# EAGLE design BlackIce_V (EAGLE 7.5.0)
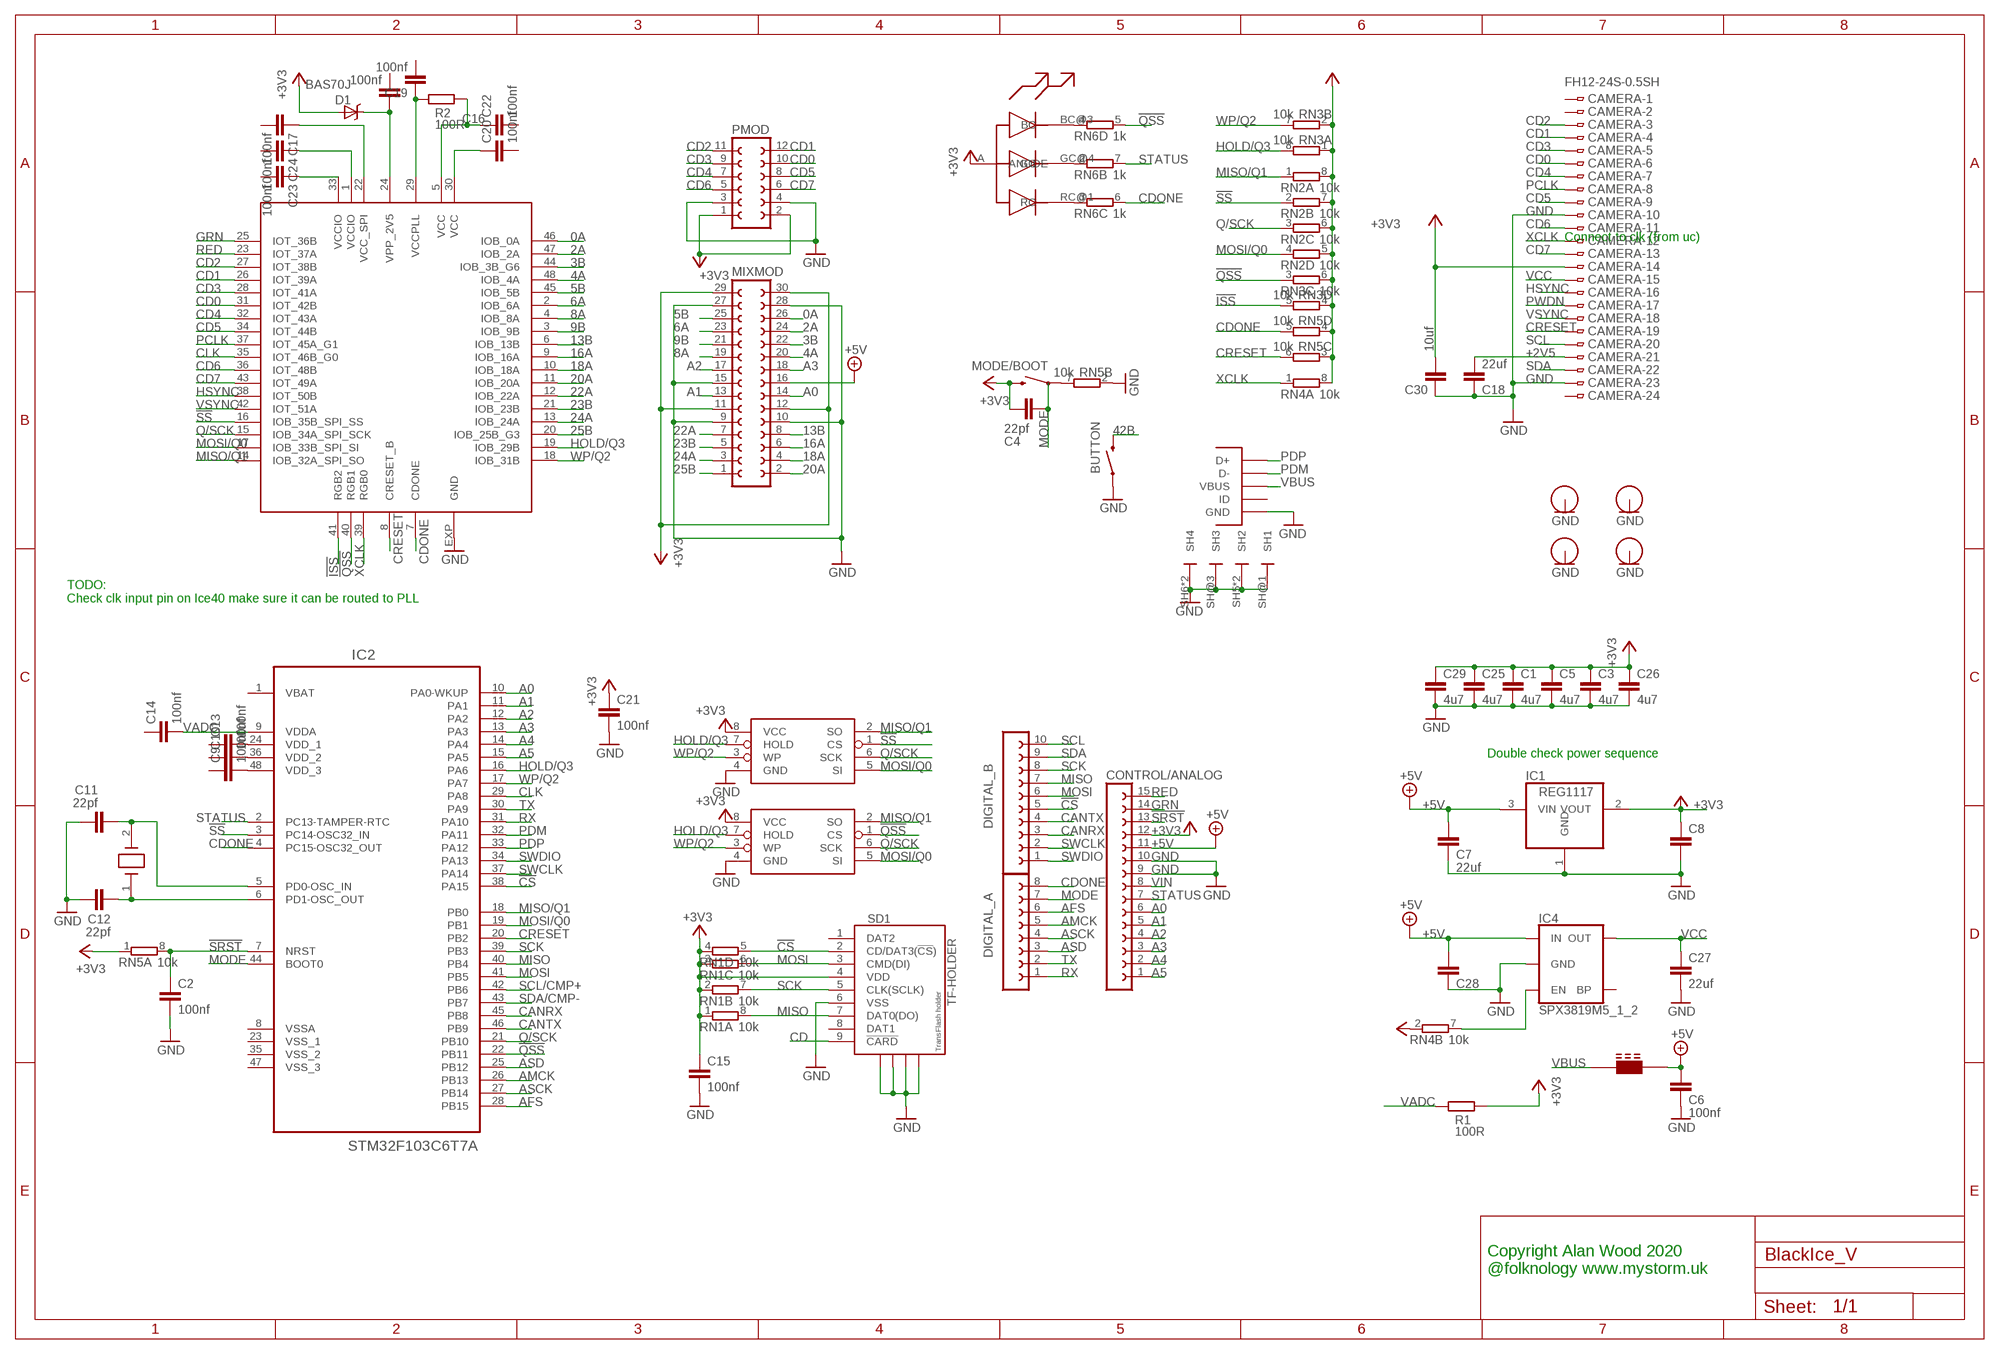
[diagram p0: schematic, sheet 1]

## Parts
BUTTON  SWITCH-MOMENTARY-2SMD-1101NE  [TACTILE-SWITCH-1101NE]
C1  4u7  C-EUC0603  [C0603]
C2  100nf  C-EUC0402  [C0402]
C3  4u7  C-EUC0603  [C0603]
C4  22pf  C-EUC0603  [C0603]
C5  4u7  C-EUC0603  [C0603]
C6  100nf  C-EUC0402  [C0402]
C7  22uf  C-EUC0603  [C0603]
C8  22uf  C-EUC0603  [C0603]
C9  100nf  C-EUC0402  [C0402]
C10  100nf  C-EUC0402  [C0402]
C11  22pf  C-EUC0603  [C0603]
C12  22pf  C-EUC0603  [C0603]
C13  100nf  C-EUC0402  [C0402]
C14  100nf  C-EUC0402  [C0402]
C15  100nf  C-EUC0402  [C0402]
C16  100nf  C-EUC0402  [C0402]
C17  100nf  C-EUC0402  [C0402]
C18  22uf  C-EUC0603  [C0603]
C19  100nf  C-EUC0402  [C0402]
C20  100nf  C-EUC0402  [C0402]
C21  100nf  C-EUC0402  [C0402]
C22  100nf  C-EUC0402  [C0402]
C23  100nf  C-EUC0402  [C0402]
C24  100nf  C-EUC0402  [C0402]
C25  4u7  C-EUC0603  [C0603]
C26  4u7  C-EUC0603  [C0603]
C27  22uf  C-EUC0603  [C0603]
C28  22uf  C-EUC0603  [C0603]
C29  4u7  C-EUC0603  [C0603]
C30  10uf  C-EUC0603  [C0603]
CAMERA  FH12-24S-0.5SH  [FH12-24S-0.5SH]
CONTROL/ANALOG  FE15-1  [FE15]
D1  BAS70J  [SOD-323]
DIGITAL_A  FE08-1  [FE08]
DIGITAL_B  FE10-1  [FE10]
FB1  FERRITE_BEAD  [0603]
H1  HOLE2.5MM  [2.5MM-HOLE]
H2  HOLE2.5MM  [2.5MM-HOLE]
H3  HOLE2.5MM  [2.5MM-HOLE]
H4  HOLE2.5MM  [2.5MM-HOLE]
IC1  REG1117  [SOT223]
IC2  STM32F103C6T7A  [QFP50P900X900X160-48N]
IC3  ICE40UP5K  [QFN48]
IC4  SPX3819M5_1_2  V_REG_SPX3819-SOT23-5  [SOT23-5]
IC5  AT25SDF041A  [SOIC-8-NARROW]
IC6  AT25SDF041A  [SOIC-8-NARROW]
MIXMOD  FE15-2  [FE15-2]
MODE/BOOT  SWITCH-MOMENTARY-2SMD-1101NE  [TACTILE-SWITCH-1101NE]
PMOD  FE06-2W  [FE06-2W]
R1  100R  R-EU_R0402  [R0402]
R2  100R  R-EU_R0402  [R0402]
RN1  10k  4R-N0603-ARV  [0603-ARV]
RN2  10k  4R-N0603-ARV  [0603-ARV]
RN3  10k  4R-N0603-ARV  [0603-ARV]
RN4  10k  4R-N0603-ARV  [0603-ARV]
RN5  10k  4R-N0603-ARV  [0603-ARV]
RN6  1k  4R-N0603-ARV  [0603-ARV]
SD1  TF-HOLDER  [TF-PULL]
U$1  FCI-MICROUSB-B-PEG  [MICROUSB-B-PEG]
U$4  RGB-PLCC-4  [PLCC-4-SMALL]
X1  HC49UP  [HC49UP]

## Nets
0A: IC3.46(IOB_0A) MIXMOD.26
2A: IC3.47(IOB_2A) MIXMOD.24
3B: IC3.44(IOB_3B_G6) MIXMOD.22
4A: IC3.48(IOB_4A) MIXMOD.20
5B: IC3.45(IOB_5B) MIXMOD.25
6A: IC3.2(IOB_6A) MIXMOD.23
8A: IC3.4(IOB_8A) MIXMOD.19
9B: IC3.3(IOB_9B) MIXMOD.21
13B: IC3.6(IOB_13B) MIXMOD.8
16A: IC3.9(IOB_16A) MIXMOD.6
18A: IC3.10(IOB_18A) MIXMOD.4
20A: IC3.11(IOB_20A) MIXMOD.2
22A: IC3.12(IOB_22A) MIXMOD.7
23B: IC3.21(IOB_23B) MIXMOD.5
24A: IC3.13(IOB_24A) MIXMOD.3
25B: IC3.20(IOB_25B_G3) MIXMOD.1
42B: BUTTON.2
!CS: DIGITAL_B.5 IC2.38(PA15) RN1.5 SD1.2(CD/DAT3(!CS!))
!ISS: IC3.41(RGB2) RN3.5
!QSS: IC2.22(PB11) IC3.40(RGB1) IC6.1(CS) RN3.3 RN6.5
!SRST: C2.1 CONTROL/ANALOG.13 IC2.7(NRST) RN5.8
!SS: IC2.3(PC14-OSC32_IN) IC3.16(IOB_35B_SPI_SS) IC5.1(CS) RN2.2
+2V5: C16.1 C18.1 CAMERA.21 D1.C IC3.24(VPP_2V5)
+3V3: C1.1 C3.1 C4.2 C5.1 C8.1 C15.1 C21.1 C25.1 C26.1 C29.1 C30.2 CAMERA.14 CONTROL/ANALOG.12 D1.A IC1.2(VOUT) IC5.8(VCC) IC6.8(VCC) MIXMOD.11 MIXMOD.12 MIXMOD.29 MIXMOD.30 MODE/BOOT.2 PMOD.1 PMOD.2 R1.1 RN1.1 RN1.2 RN1.3 RN1.4 RN2.5 RN2.6 RN2.7 RN2.8 RN3.1 RN3.2 RN3.4 RN3.6 RN4.2 RN4.8 RN5.1 RN5.3 RN5.4 SD1.4(VDD) U$4.A(ANODE)
+5V: C6.2 C7.2 C28.2 CONTROL/ANALOG.11 FB1.2 IC1.3(VIN) IC4.1(IN) MIXMOD.16
A0: CONTROL/ANALOG.6 IC2.10(PA0-WKUP) MIXMOD.14
A1: CONTROL/ANALOG.5 IC2.11(PA1) MIXMOD.13
A2: CONTROL/ANALOG.4 IC2.12(PA2) MIXMOD.17
A3: CONTROL/ANALOG.3 IC2.13(PA3) MIXMOD.18
A4: CONTROL/ANALOG.2 IC2.14(PA4)
A5: CONTROL/ANALOG.1 IC2.15(PA5)
AFS: DIGITAL_A.6 IC2.28(PB15)
AMCK: DIGITAL_A.5 IC2.26(PB13)
ASCK: DIGITAL_A.4 IC2.27(PB14)
ASD: DIGITAL_A.3 IC2.25(PB12)
CANRX: DIGITAL_B.3 IC2.45(PB8)
CANTX: DIGITAL_B.4 IC2.46(PB9)
CD: SD1.9(!CARD)
CD0: CAMERA.6 IC3.31(IOT_42B) PMOD.10
CD1: CAMERA.4 IC3.26(IOT_39A) PMOD.12
CD2: CAMERA.3 IC3.27(IOT_38B) PMOD.11
CD3: CAMERA.5 IC3.28(IOT_41A) PMOD.9
CD4: CAMERA.7 IC3.32(IOT_43A) PMOD.7
CD5: CAMERA.9 IC3.34(IOT_44B) PMOD.8
CD6: CAMERA.11 IC3.36(IOT_48B) PMOD.5
CD7: CAMERA.13 IC3.43(IOT_49A) PMOD.6
CDONE: DIGITAL_A.8 IC2.4(PC15-OSC32_OUT) IC3.7(CDONE) RN5.5 RN6.6
CLK: IC2.29(PA8) IC3.35(IOT_46B_G0)
CRESET: CAMERA.19 IC2.20(PB2) IC3.8(CRESET_B) RN5.6
GND: BUTTON.1 C1.2 C2.2 C3.2 C5.2 C6.1 C7.1 C8.2 C11.1 C12.1 C15.2 C18.2 C21.2 C25.2 C26.2 C27.2 C28.1 C29.2 C30.1 CAMERA.10 CAMERA.23 CONTROL/ANALOG.9 CONTROL/ANALOG.10 H1.P$1(P) H2.P$1(P) H3.P$1(P) H4.P$1(P) IC1.1(GND) IC3.EXP(GND) IC4.2(GND) IC5.4(GND) IC6.4(GND) MIXMOD.9 MIXMOD.10 MIXMOD.15 MIXMOD.27 MIXMOD.28 PMOD.3 PMOD.4 RN5.2 SD1.6(VSS) SD1.S1 SD1.S2 SD1.S3 SD1.S4 U$1.P$5(GND) U$1.SH5(SH2) U$1.SH6(SH4) U$1.SH@1(SH1) U$1.SH@2(SH2) U$1.SH@3(SH3) U$1.SH@4(SH4)
GRN: CONTROL/ANALOG.14 IC3.25(IOT_36B)
HOLD/Q3: IC2.16(PA6) IC3.19(IOB_29B) IC5.7(HOLD) IC6.7(HOLD) RN3.8
HSYNC: CAMERA.16 IC3.38(IOT_50B)
MISO: DIGITAL_B.7 IC2.40(PB4) RN1.8 SD1.7(DAT0(DO))
MISO/Q1: IC2.18(PB0) IC3.14(IOB_32A_SPI_SO) IC5.2(SO) IC6.2(SO) RN2.1
MODE: C4.1 DIGITAL_A.7 IC2.44(BOOT0)
MOSI: DIGITAL_B.6 IC2.41(PB5) RN1.6 SD1.3(CMD(DI))
MOSI/Q0: IC2.19(PB1) IC3.17(IOB_33B_SPI_SI) IC5.5(SI) IC6.5(SI) RN2.4
N$2: RN6.4 U$4.BC@3(BC)
N$7: RN6.2 U$4.GC@4(GC)
N$9: RN6.3 U$4.RC@1(RC)
N$11: MODE/BOOT.1 RN5.7
N$12: IC4.3(EN) RN4.7
N$22: C12.2 IC2.6(PD1-OSC_OUT) X1.1(X1)
N$23: C11.2 IC2.5(PD0-OSC_IN) X1.2(X2)
N$29: C13.2 IC2.24(VDD_1)
N$30: C10.2 IC2.36(VDD_2)
N$31: C9.2 IC2.48(VDD_3)
N$32: C23.1 IC3.33(VCCIO)
N$33: C24.1 IC3.1(VCCIO)
N$34: C17.1 IC3.22(VCC_SPI)
N$36: C19.1 IC3.29(VCCPLL) R2.2
N$37: C22.1 IC3.5(VCC) R2.1
N$38: C20.1 IC3.30(VCC)
PCLK: CAMERA.8 IC3.37(IOT_45A_G1)
PDM: IC2.32(PA11) U$1.P$2(D-)
PDP: IC2.33(PA12) U$1.P$3(D+)
PWDN: CAMERA.17
Q/SCK: IC2.21(PB10) IC3.15(IOB_34A_SPI_SCK) IC5.6(SCK) IC6.6(SCK) RN2.3
RED: CONTROL/ANALOG.15 IC3.23(IOT_37A)
RX: DIGITAL_A.1 IC2.31(PA10)
SCK: DIGITAL_B.8 IC2.39(PB3) RN1.7 SD1.5(CLK(SCLK))
SCL: CAMERA.20 DIGITAL_B.10
SCL/CMP+: IC2.42(PB6)
SDA: CAMERA.22 DIGITAL_B.9
SDA/CMP-: IC2.43(PB7)
STATUS: CONTROL/ANALOG.7 IC2.2(PC13-TAMPER-RTC)
SWCLK: DIGITAL_B.2 IC2.37(PA14)
SWDIO: DIGITAL_B.1 IC2.34(PA13)
TX: DIGITAL_A.2 IC2.30(PA9)
VADC: C14.2 IC2.9(VDDA) R1.2
VBUS: FB1.1 U$1.P$1(VBUS)
VCC: C27.1 CAMERA.15 IC4.5(OUT)
VIN: CONTROL/ANALOG.8
VSYNC: CAMERA.18 IC3.42(IOT_51A)
WP/Q2: IC2.17(PA7) IC3.18(IOB_31B) IC5.3(WP) IC6.3(WP) RN3.7
XCLK: CAMERA.12 IC3.39(RGB0) RN4.1
Unconnected: C9.1 C10.1 C13.1 C14.1 C16.2 C17.2 C19.2 C20.2 C22.2 C23.2 C24.2 CAMERA.1 CAMERA.2 CAMERA.24 IC2.8(VSSA) IC2.23(VSS_1) IC2.35(VSS_2) IC2.47(VSS_3) IC4.4(BP) RN4.3 RN4.4 RN4.5 RN4.6 RN6.1 RN6.7 RN6.8 SD1.1(DAT2) SD1.8(DAT1) U$1.P$4(ID)

## Notes on the sheet
- Connect to clk (from uc)
- TODO:
  Check clk input pin on Ice40 make sure it can be routed to PLL
- Double check power sequence
- Copyright Alan Wood 2020
  @folknology www.mystorm.uk

## Power pins joined to a net without a drawn wire
VBAT: IC2.1(VBAT)

## Library data of the parts
BUTTON MODE/BOOT = SparkFun-Electromechanical:SWITCH-MOMENTARY-2: Various NO switches- pushbuttons, reed, etc; PROD_ID: SWCH-00815
C1-C30 = rcl:C-EU: CAPACITOR, European symbol
CAMERA = con-hirose:FH12-24S-0.5S: 0.5mm Pitch Connectors For FPC/FFC Source: Data sheet <http://www.hirose.co.jp/cataloge_hp/e58605370.pdf>; MPN: FH12-24S-0.5SH(55); OC_FARNELL: 1324552; OC_NEWARK: 34M6170
CONTROL/ANALOG = con-lsta:FE15-1: FEMALE HEADER; OC_FARNELL: unknown; OC_NEWARK: unknown
D1 = ELL-i-DiscreteSemi:BAS70: Silicon Schottky Diodes General-purpose diode for high-speed switching. Maximum forward current 70 mA Maxiumum forward voltage drop Vf 0.410 mV Maximum reverse voltage 70V
DIGITAL_A = con-lsta:FE08-1: FEMALE HEADER; OC_FARNELL: unknown; OC_NEWARK: unknown
DIGITAL_B = con-lsta:FE10-1: FEMALE HEADER; OC_FARNELL: unknown; OC_NEWARK: unknown
FB1 = amino:FERRITE_BEAD
H1-H4 = amino:HOLE
IC1 = burr-brown:REG1117: 800mA and 1A Low Dropout (LDO) Positive Regulator 1.8V, 2.5V, 2.85V, 3.3V, 5V, and Adj; MPN: REG1117; OC_FARNELL: 1097566; OC_NEWARK: 14P6981
IC2 = stm:STM32F103C6T7A: IC, MCU, 32BIT, 32KB FLASH, 48 LQFP; MPN: STM32F103C6T7A; OC_FARNELL: 2060890; OC_NEWARK: 65T3773; PACKAGE: 48LQFP; SUPPLIER: STMicroelectronics
IC3 = amino:ICE40UP5K
IC4 = SparkFun-IC-Power:V_REG_SPX3819: SPX3819 Voltage Regulator 3.3V 500mA, 16V input Datasheet <https://www.exar.com/content/document.ashx?id=22106> SparkFun Products: SparkFun Serial Controlled Motor Driver <https://www.sparkfun.com/products/13911>; PROD_ID: VREG-13321; VALUE: SPX3819M5_3_3
IC5 IC6 = amino:AT25SDF041A
MIXMOD = con-lsta:FE15-2: FEMALE HEADER; OC_FARNELL: unknown; OC_NEWARK: unknown
PMOD = con-lsta:FE06-2W: FEMALE HEADER; OC_FARNELL: unknown; OC_NEWARK: unknown
R1 R2 = resistor:R-EU_: RESISTOR, European symbol
RN1-RN6 = resistor-dil:4R-N: Array Chip Resistor Source: RS Component / Phycomp; OC_FARNELL: unknown; OC_NEWARK: unknown
SD1 = sd-mmc:TF-HOLDER: TF / Micro SD socket is PUSH-PUSH type, the card can be pushed into and auto locked and pushed out by simply press the card. Surface Mounting type.
U$1 = amino:FCI-MICROUSB-B-PEG
U$4 = amino:RGB-PLCC-4
X1 = amino:HC49UP

## Board
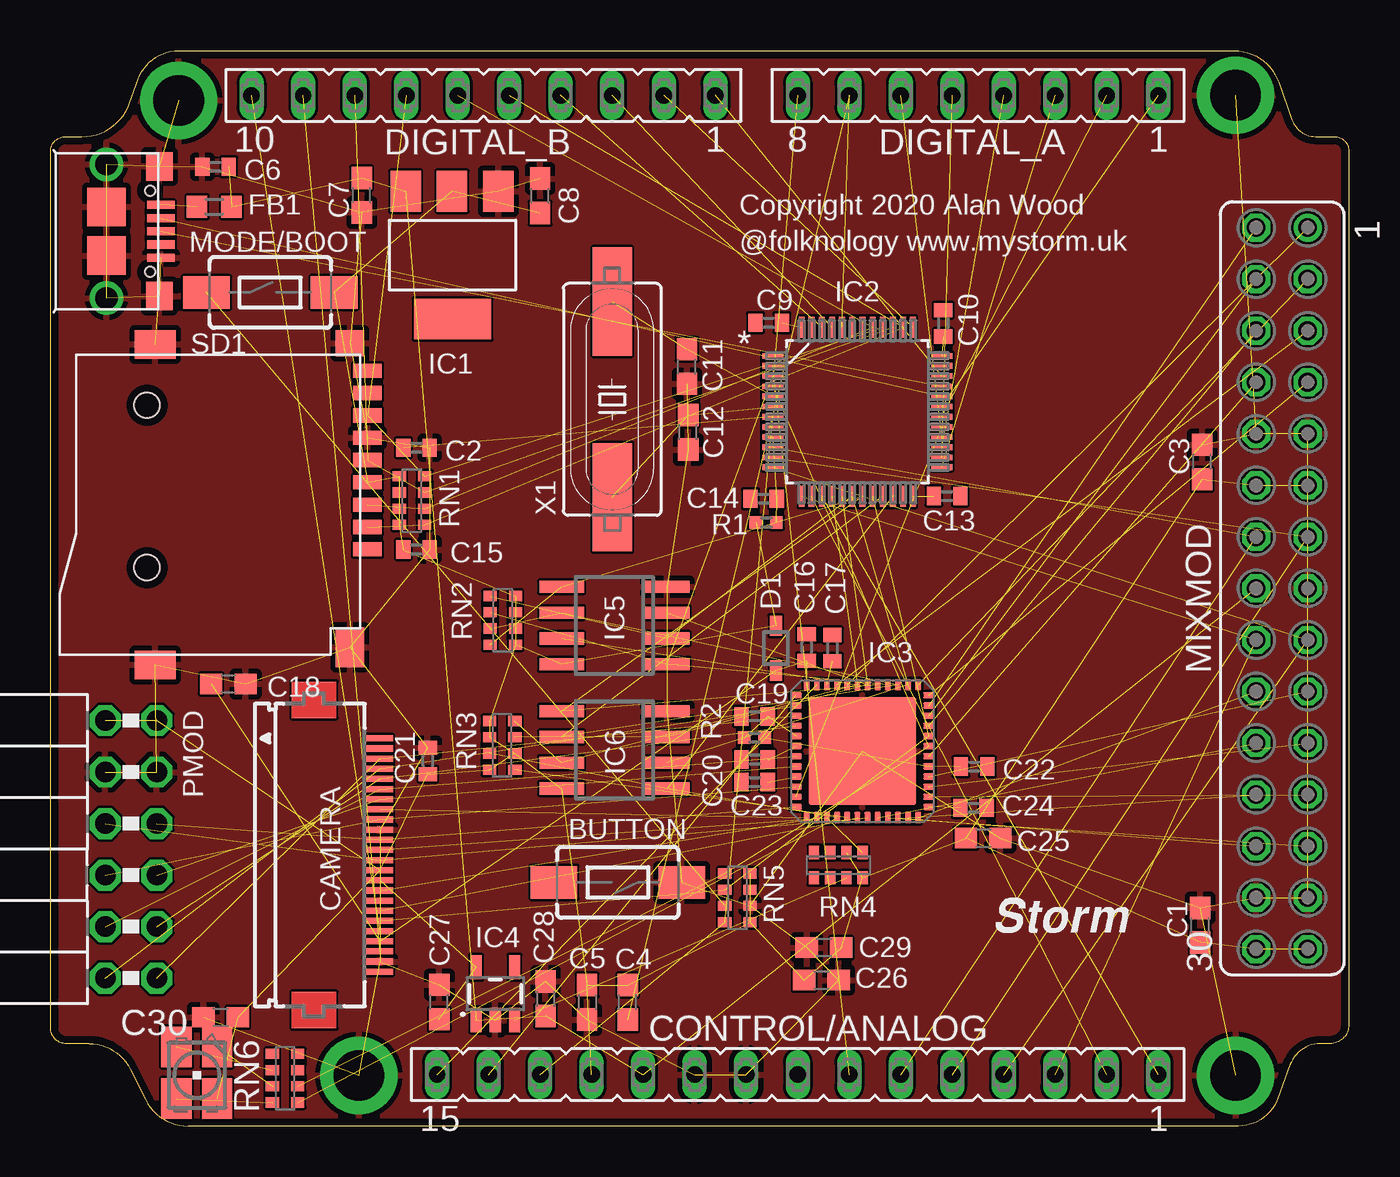
[diagram p1: board, top side]
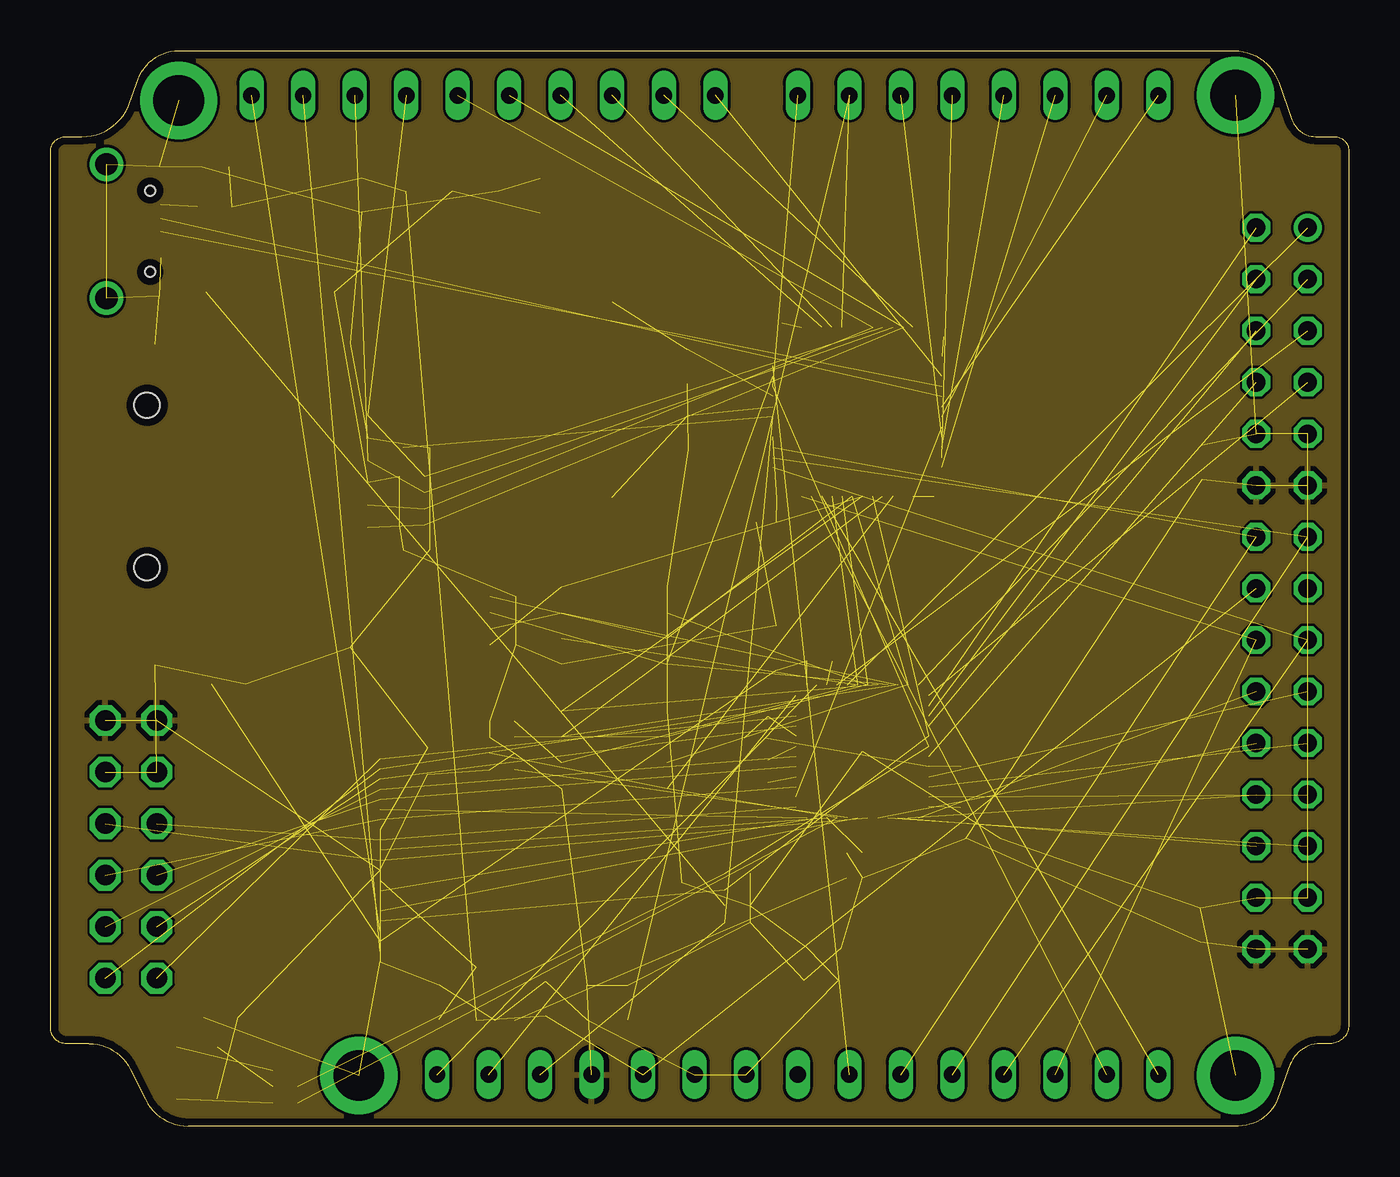
[diagram p2: board, inner layer Route2]
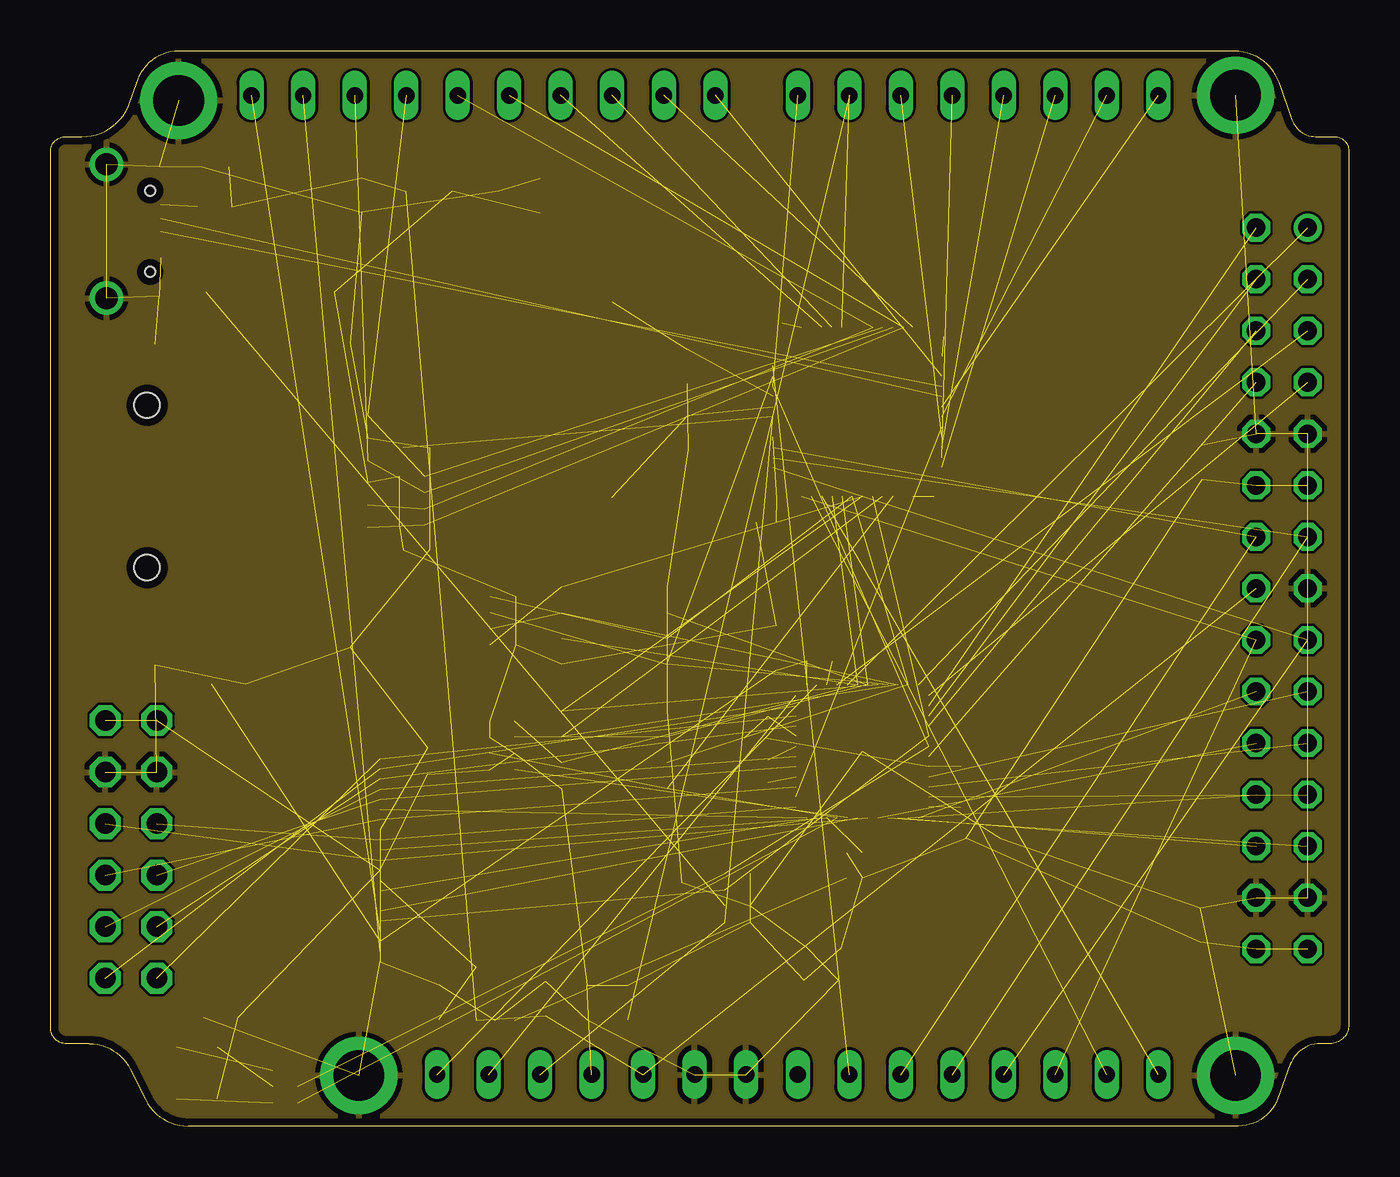
[diagram p3: board, inner layer Route15]
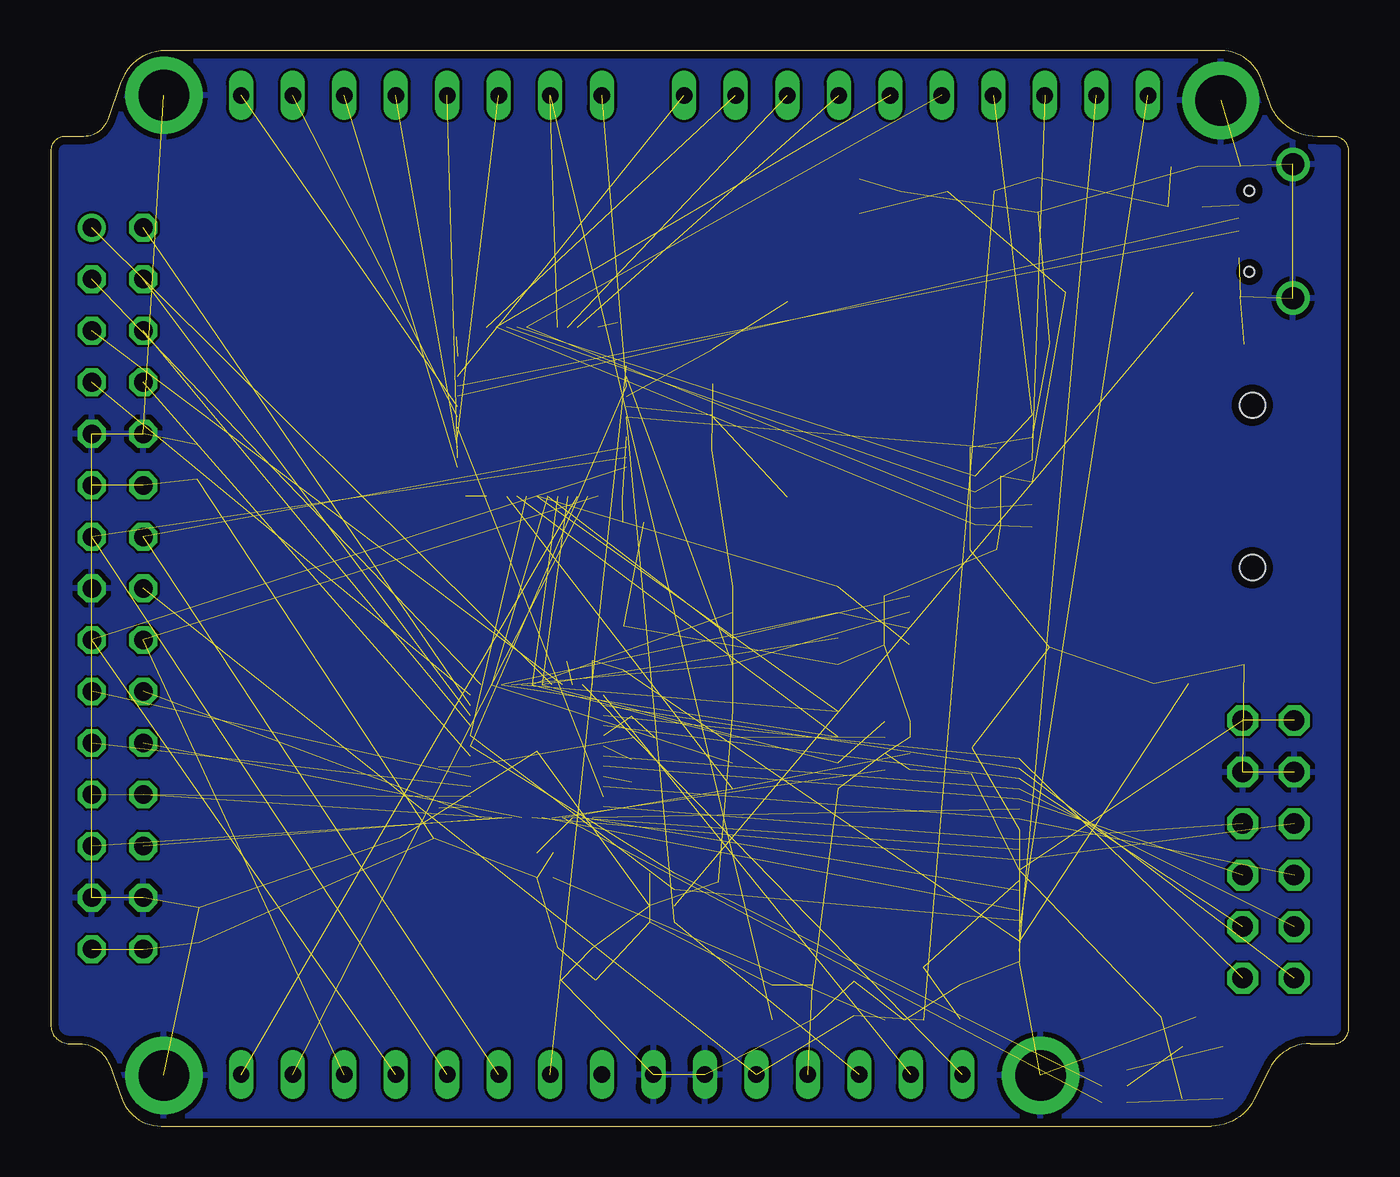
[diagram p4: board, bottom side, seen from below]

Size 64 x 53 mm. Coordinates in mm from the lower left corner, seen from the top.
Outline: 1.9,4.06 0.76,4.06 arc-90 0,4.83 0,48.05 arc-90 0.72,48.77 1.53,48.77 arc70 3.9,50.43 4.32,51.6 arc-70 6.31,53 58.36,53 arc-71 60.54,51.45 61.19,49.61 arc71 62.38,48.77 63.29,48.77 arc-90 64,48.06 64,48 64,5 arc-90 63.07,4.06 62.6,4.06 arc70 61.1,3.01 60.5,1.36 arc-70 58.55,0 6.78,0 arc-63 4.69,1.29 3.93,2.81 arc63 1.9,4.06
Copper layers (1*2*15*16): Top 0.035559375mm / dielectric 0.17018125mm / Route2 0.01778125mm / dielectric 47mil / Route15 0.01778125mm / dielectric 0.17018125mm / Bottom 0.035559375mm
Design rules "oshpark-4layer": minimum track width 5mil, minimum drill 10mil, track to track 5mil, track to pad 5mil, pad to pad 5mil, via to via 5mil, smd to smd 5mil, copper to edge 15mil, drill to drill 6mil, minimum pad ring 4mil, minimum via ring 4mil, stop-mask expansion 2.5mil, vias tented up to drill 0mil, thermal gap 10mil

### Footprints (pad centres in the part's own frame; a part is rotated, then mirrored left to right if it is on the bottom)
TACTILE-SWITCH-1101NE = smd 2.3 x 1.6: 1 -3.15,0; 2 3.15,0
C0603 = smd 1.1 x 1: 1 -0.85,0; 2 0.85,0
C0402 = smd 0.7 x 0.9: 1 -0.65,0; 2 0.65,0
FH12-24S-0.5SH = smd 0.3 x 1.3: 1 -5.75,3.25; 2 -5.25,3.25; 3 -4.75,3.25; 4 -4.25,3.25; 5 -3.75,3.25; 6 -3.25,3.25; 7 -2.75,3.25; 8 -2.25,3.25; 9 -1.75,3.25; 10 -1.25,3.25; 11 -0.75,3.25; 12 -0.25,3.25; 13 0.25,3.25; 14 0.75,3.25; 15 1.25,3.25; 16 1.75,3.25; 17 2.25,3.25; 18 2.75,3.25; 19 3.25,3.25; 20 3.75,3.25; 21 4.25,3.25; 22 4.75,3.25; 23 5.25,3.25; 24 5.75,3.25
FE15 = drill 0.813 long: 1 -17.78,0; 2 -15.24,0; 3 -12.7,0; 4 -10.16,0; 5 -7.62,0; 6 -5.08,0; 7 -2.54,0; 8 0,0; 9 2.54,0; 10 5.08,0; 11 7.62,0; 12 10.16,0; 13 12.7,0; 14 15.24,0; 15 17.78,0
SOD-323 = smd 1 x 0.6: A 1.1,0; C -1.1,0
FE08 = drill 0.813 long: 1 -8.89,0; 2 -6.35,0; 3 -3.81,0; 4 -1.27,0; 5 1.27,0; 6 3.81,0; 7 6.35,0; 8 8.89,0
FE10 = drill 0.813 long: 1 -11.43,0; 2 -8.89,0; 3 -6.35,0; 4 -3.81,0; 5 -1.27,0; 6 1.27,0; 7 3.81,0; 8 6.35,0; 9 8.89,0; 10 11.43,0
0603 = smd 1 x 1.1: 1 -0.85,0; 2 0.85,0
2.5MM-HOLE = drill 2.5 pad 3.81: P$1 0,0
SOT223 = smd 1.499 x 2.007: 1 -2.261,-3.15; 2 0.025,-3.15; 3 2.311,-3.15 | smd 3.81 x 2.007: 4 0,3.15
QFP50P900X900X160-48N = smd 1.041 x 0.279: 1 -4.166,2.743; 2 -4.166,2.261; 3 -4.166,1.753; 4 -4.166,1.245; 5 -4.166,0.762; 6 -4.166,0.254; 7 -4.166,-0.254; 8 -4.166,-0.762; 9 -4.166,-1.245; 10 -4.166,-1.753; 11 -4.166,-2.261; 12 -4.166,-2.743; 25 4.166,-2.743; 26 4.166,-2.261; 27 4.166,-1.753; 28 4.166,-1.245; 29 4.166,-0.762; 30 4.166,-0.254; 31 4.166,0.254; 32 4.166,0.762; 33 4.166,1.245; 34 4.166,1.753; 35 4.166,2.261; 36 4.166,2.743 | smd 0.279 x 1.041: 13 -2.743,-4.166; 14 -2.261,-4.166; 15 -1.753,-4.166; 16 -1.245,-4.166; 17 -0.762,-4.166; 18 -0.254,-4.166; 19 0.254,-4.166; 20 0.762,-4.166; 21 1.245,-4.166; 22 1.753,-4.166; 23 2.261,-4.166; 24 2.743,-4.166; 37 2.743,4.166; 38 2.261,4.166; 39 1.753,4.166; 40 1.245,4.166; 41 0.762,4.166; 42 0.254,4.166; 43 -0.254,4.166; 44 -0.762,4.166; 45 -1.245,4.166; 46 -1.753,4.166; 47 -2.261,4.166; 48 -2.743,4.166
QFN48 = smd 0.55 x 0.3: 1 -3.275,2.75; 2 -3.275,2.25; 3 -3.275,1.75; 4 -3.275,1.25; 5 -3.275,0.75; 6 -3.275,0.25; 7 -3.275,-0.25; 8 -3.275,-0.75; 9 -3.275,-1.25; 10 -3.275,-1.75; 11 -3.275,-2.25; 12 -3.275,-2.75; 25 3.275,-2.75; 26 3.275,-2.25; 27 3.275,-1.75; 28 3.275,-1.25; 29 3.275,-0.75; 30 3.275,-0.25; 31 3.275,0.25; 32 3.275,0.75; 33 3.275,1.25; 34 3.275,1.75; 35 3.275,2.25; 36 3.275,2.75 | smd 0.3 x 0.55: 13 -2.75,-3.275; 14 -2.25,-3.275; 15 -1.75,-3.275; 16 -1.25,-3.275; 17 -0.75,-3.275; 18 -0.25,-3.275; 19 0.25,-3.275; 20 0.75,-3.275; 21 1.25,-3.275; 22 1.75,-3.275; 23 2.25,-3.275; 24 2.75,-3.275; 37 2.75,3.275; 38 2.25,3.275; 39 1.75,3.275; 40 1.25,3.275; 41 0.75,3.275; 42 0.25,3.275; 43 -0.25,3.275; 44 -0.75,3.275; 45 -1.25,3.275; 46 -1.75,3.275; 47 -2.25,3.275; 48 -2.75,3.275 | smd 5.309 x 5.309: EXP 0,0
SOT23-5 = smd 0.55 x 1.2: 1 -0.95,-1.3; 2 0,-1.3; 3 0.95,-1.3; 4 0.95,1.3; 5 -0.95,1.3
SOIC-8-NARROW = smd 0.6 x 2.2: 1 -1.905,-2.6; 2 -0.635,-2.6; 3 0.635,-2.6; 4 1.905,-2.6; 5 1.905,2.6; 6 0.635,2.6; 7 -0.635,2.6; 8 -1.905,2.6
FE15-2 = drill 0.914: 1 -17.78,1.27 | drill 0.914 octagon: 2 -17.78,-1.27; 3 -15.24,1.27; 4 -15.24,-1.27; 5 -12.7,1.27; 6 -12.7,-1.27; 7 -10.16,1.27; 8 -10.16,-1.27; 9 -7.62,1.27; 10 -7.62,-1.27; 11 -5.08,1.27; 12 -5.08,-1.27; 13 -2.54,1.27; 14 -2.54,-1.27; 15 0,1.27; 16 0,-1.27; 17 2.54,1.27; 18 2.54,-1.27; 19 5.08,1.27; 20 5.08,-1.27; 21 7.62,1.27; 22 7.62,-1.27; 23 10.16,1.27; 24 10.16,-1.27; 25 12.7,1.27; 26 12.7,-1.27; 27 15.24,1.27; 28 15.24,-1.27; 29 17.78,1.27; 30 17.78,-1.27
FE06-2W = drill 1.016 octagon: 1 -6.35,1.27; 2 -6.35,-1.27; 3 -3.81,1.27; 4 -3.81,-1.27; 5 -1.27,1.27; 6 -1.27,-1.27; 7 1.27,1.27; 8 1.27,-1.27; 9 3.81,1.27; 10 3.81,-1.27; 11 6.35,1.27; 12 6.35,-1.27
R0402 = smd 0.61 x 0.61: 1 -0.508,0; 2 0.508,0
0603-ARV = smd 0.5 x 0.65: 1 -1.2,-0.625; 2 -0.4,-0.625; 3 0.4,-0.625; 4 1.2,-0.625; 5 1.2,0.625; 6 0.4,0.625; 7 -0.4,0.625; 8 -1.2,0.625
TF-PULL = smd 0.7 x 1.4: 1 -2.2,-7.62; 2 -1.1,-7.62; 3 0,-7.62; 4 1.1,-7.62; 5 2.2,-7.62; 6 3.3,-7.62; 7 4.4,-7.62; 8 5.5,-7.62; 9 6.6,-7.62 | smd 1.4 x 2: S1 -7.9,2.85; S2 7.9,2.85 | smd 1.28 x 1.4: S3 7.96,-6.75 | smd 1.95 x 1.4: S4 -7.025,-6.75 | hole 1.25: -3.1,3.25; 4.9,3.25
MICROUSB-B-PEG = smd 0.4 x 1.35: P$1 -1.3,2.675; P$2 -0.65,2.675; P$3 0,2.675; P$4 0.65,2.675; P$5 1.3,2.675 | drill 1.1: SH5 -3.3,0; SH6 3.3,0 | smd 1.4 x 1.3: SH@1 -3.2,2.6; SH@4 3.2,2.6 | smd 1.9 x 1.9: SH@2 -1.2,0; SH@3 1.2,0 | hole 0.5: -2,2.15; 2,2.15
PLCC-4-SMALL = smd 1.5 x 2: A -1,1.15; BC@3 1,1.15; GC@4 1,-1.4; RC@1 -1,-1.4
HC49UP = smd 5.334 x 1.93: 1 -4.826,0; 2 4.826,0

### Placement (x,y rotation side)
BUTTON  27.96,12.01 180 top
C1  56.67,9.91 90 top
C2  18.03,33.43 0 top
C3  56.77,32.73 90 top
C4  28.45,6.1 90 top
C5  26.45,6.1 270 top
C6  8.13,47.28 0 top
C7  15.34,45.88 90 top
C8  24.13,45.85 90 top
C9  35.4,39.59 0 top
C10  44.01,39.56 270 top
C11  31.37,37.43 90 top
C12  31.43,34.19 90 top
C13  44.2,31.05 180 top
C14  35.15,30.92 0 top
C15  18.03,28.42 0 top
C16  37.27,23.59 90 top
C17  38.54,23.56 90 top
C18  8.76,21.79 0 top
C19  34.7,20.19 180 top
C20  34.7,18.07 180 top
C21  18.59,18 90 top
C22  45.53,17.72 0 top
C23  34.7,16.95 180 top
C24  45.5,15.68 0 top
C25  45.97,14.19 0 top
C26  38,7.19 0 top
C27  19.16,6.12 90 top
C28  24.4,6.28 270 top
C29  38.13,8.79 180 top
C30  8.38,5.36 0 top
CAMERA  12.98,13.36 270 top
CONTROL/ANALOG  36.83,2.54 180 top
D1  35.75,23.56 90 top
DIGITAL_A  45.72,50.8 180 top
DIGITAL_B  21.34,50.8 180 top
FB1  8.06,45.31 0 top
H1  58.42,50.8 0 top
H2  6.31,50.55 0 top
H3  15.2,2.5 0 top
H4  58.42,2.5 0 top
IC1  19.81,42.93 180 top
IC2  39.77,35.21 0 top
IC3  40.02,18.48 180 top
IC4  21.92,6.53 0 top
IC5  27.79,24.67 90 top
IC6  27.79,18.54 90 top
MIXMOD  60.71,26.5 270 top
MODE/BOOT  10.83,41.08 0 top
PMOD  3.96,13.64 270 top
R1  35.27,29.75 0 top
R2  34.7,19.15 180 top
RN1  17.81,30.83 270 top
RN2  22.29,24.92 270 top
RN3  22.26,18.76 270 top
RN4  38.83,12.86 180 top
RN5  33.86,11.25 90 top
RN6  11.56,2.36 270 top
SD1  8,30.63 90 top
U$1  2.75,44.1 270 top
U$4  7.21,2.51 180 top
X1  27.69,35.81 90 top

### Tracks (layer width: path | path; a pad name or v marks a point on that pad's centre or on a via)
0A  (1 unrouted)
2A  (1 unrouted)
3B  (1 unrouted)
4A  (1 unrouted)
5B  (1 unrouted)
6A  (1 unrouted)
8A  (1 unrouted)
9B  (1 unrouted)
13B  (1 unrouted)
16A  (1 unrouted)
18A  (1 unrouted)
20A  (1 unrouted)
22A  (1 unrouted)
23B  (1 unrouted)
24A  (1 unrouted)
25B  (1 unrouted)
!CS  (3 unrouted)
!ISS  (1 unrouted)
!QSS  (4 unrouted)
!SRST  (3 unrouted)
!SS  (3 unrouted)
+2V5  (4 unrouted)
+3V3  (43 unrouted)
  pour Route2: 0,53 64,53 64,0 0.03,0
+5V  (7 unrouted)
A0  (2 unrouted)
A1  (2 unrouted)
A2  (2 unrouted)
A3  (2 unrouted)
A4  (1 unrouted)
A5  (1 unrouted)
AFS  (1 unrouted)
AMCK  (1 unrouted)
ASCK  (1 unrouted)
ASD  (1 unrouted)
CANRX  (1 unrouted)
CANTX  (1 unrouted)
CD0  (2 unrouted)
CD1  (2 unrouted)
CD2  (2 unrouted)
CD3  (2 unrouted)
CD4  (2 unrouted)
CD5  (2 unrouted)
CD6  (2 unrouted)
CD7  (2 unrouted)
CDONE  (4 unrouted)
CLK  (1 unrouted)
CRESET  (3 unrouted)
GND  (51 unrouted)
  pour Bottom: 0,53 64,53 64,0 0,0
  pour Top: 0,53 64,53 64,0 0,0
  pour Route15: 0,53 64,53 64,0 0,0
GRN  (1 unrouted)
HOLD/Q3  (4 unrouted)
HSYNC  (1 unrouted)
MISO  (3 unrouted)
MISO/Q1  (4 unrouted)
MODE  (2 unrouted)
MOSI  (3 unrouted)
MOSI/Q0  (4 unrouted)
N$2  (1 unrouted)
N$7  (1 unrouted)
N$9  (1 unrouted)
N$11  (1 unrouted)
N$12  (1 unrouted)
N$22  (2 unrouted)
N$23  (2 unrouted)
N$29  (1 unrouted)
N$30  (1 unrouted)
N$31  (1 unrouted)
N$32  (1 unrouted)
N$33  (1 unrouted)
N$34  (1 unrouted)
N$36  (2 unrouted)
N$37  (2 unrouted)
N$38  (1 unrouted)
PCLK  (1 unrouted)
PDM  (1 unrouted)
PDP  (1 unrouted)
Q/SCK  (4 unrouted)
RED  (1 unrouted)
RX  (1 unrouted)
SCK  (3 unrouted)
SCL  (1 unrouted)
SDA  (1 unrouted)
STATUS  (1 unrouted)
SWCLK  (1 unrouted)
SWDIO  (1 unrouted)
TX  (1 unrouted)
VADC  (2 unrouted)
VBUS  (1 unrouted)
VCC  (2 unrouted)
VSYNC  (1 unrouted)
WP/Q2  (4 unrouted)
XCLK  (2 unrouted)

### Text on the board
tNames: Copyright 2020 Alan Wood | @folknology www.mystorm.uk
tStop: Black | Ice | V